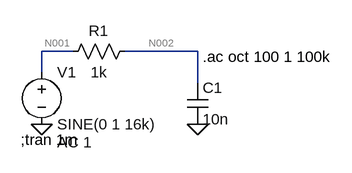
[diagram p0: schematic Draft3.asc]
Draft3.asc, the LTspice schematic file:
Version 4
SHEET 1 880 680
WIRE 128 128 80 128
WIRE 320 128 208 128
WIRE 80 160 80 128
WIRE 320 176 320 128
FLAG 80 240 0
FLAG 320 240 0
SYMBOL voltage 80 144 R0
WINDOW 123 24 124 Left 2
WINDOW 39 0 0 Left 2
SYMATTR Value2 AC 1
SYMATTR InstName V1
SYMATTR Value SINE(0 1 16k)
SYMBOL res 224 112 R90
WINDOW 0 0 56 VBottom 2
WINDOW 3 32 56 VTop 2
SYMATTR InstName R1
SYMATTR Value 1k
SYMBOL cap 304 176 R0
SYMATTR InstName C1
SYMATTR Value 10n
TEXT 48 264 Left 2 !;tran 1m
TEXT 328 136 Left 2 !.ac oct 100 1 100k

The netlist it stands for:
* Draft3.asc
V1 N001 0 SINE(0 1 16k) AC 1
R1 N002 N001 1k
C1 N002 0 10n
;tran 1m
.ac oct 100 1 100k
.backanno
.end

* Results of the author's LTspice run, read from the files saved beside the schematic
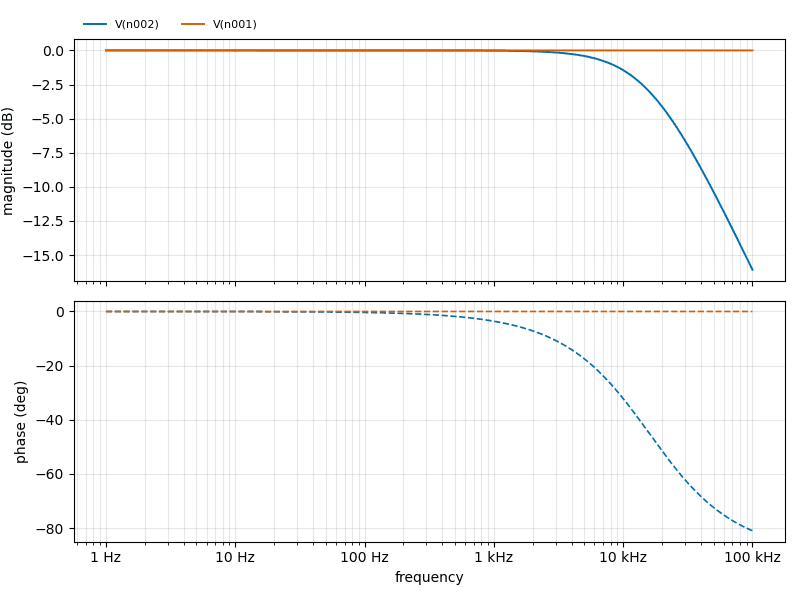
[diagram p1: AC Analysis of Draft3.asc, plotted from the saved traces]
* AC Analysis, 1 run:
*   V(n002): -0.00 dB at 1 Hz, -16.07 dB at 100 kHz, peak -0.00 dB at 1 Hz, 3 dB below the peak at 15.92 kHz
*   V(n001): 0.00 dB at 1 Hz, 0.00 dB at 100 kHz, peak 0.00 dB at 1 Hz